# Altium schematic sheet MCU_PSoC.SchDoc
size A4
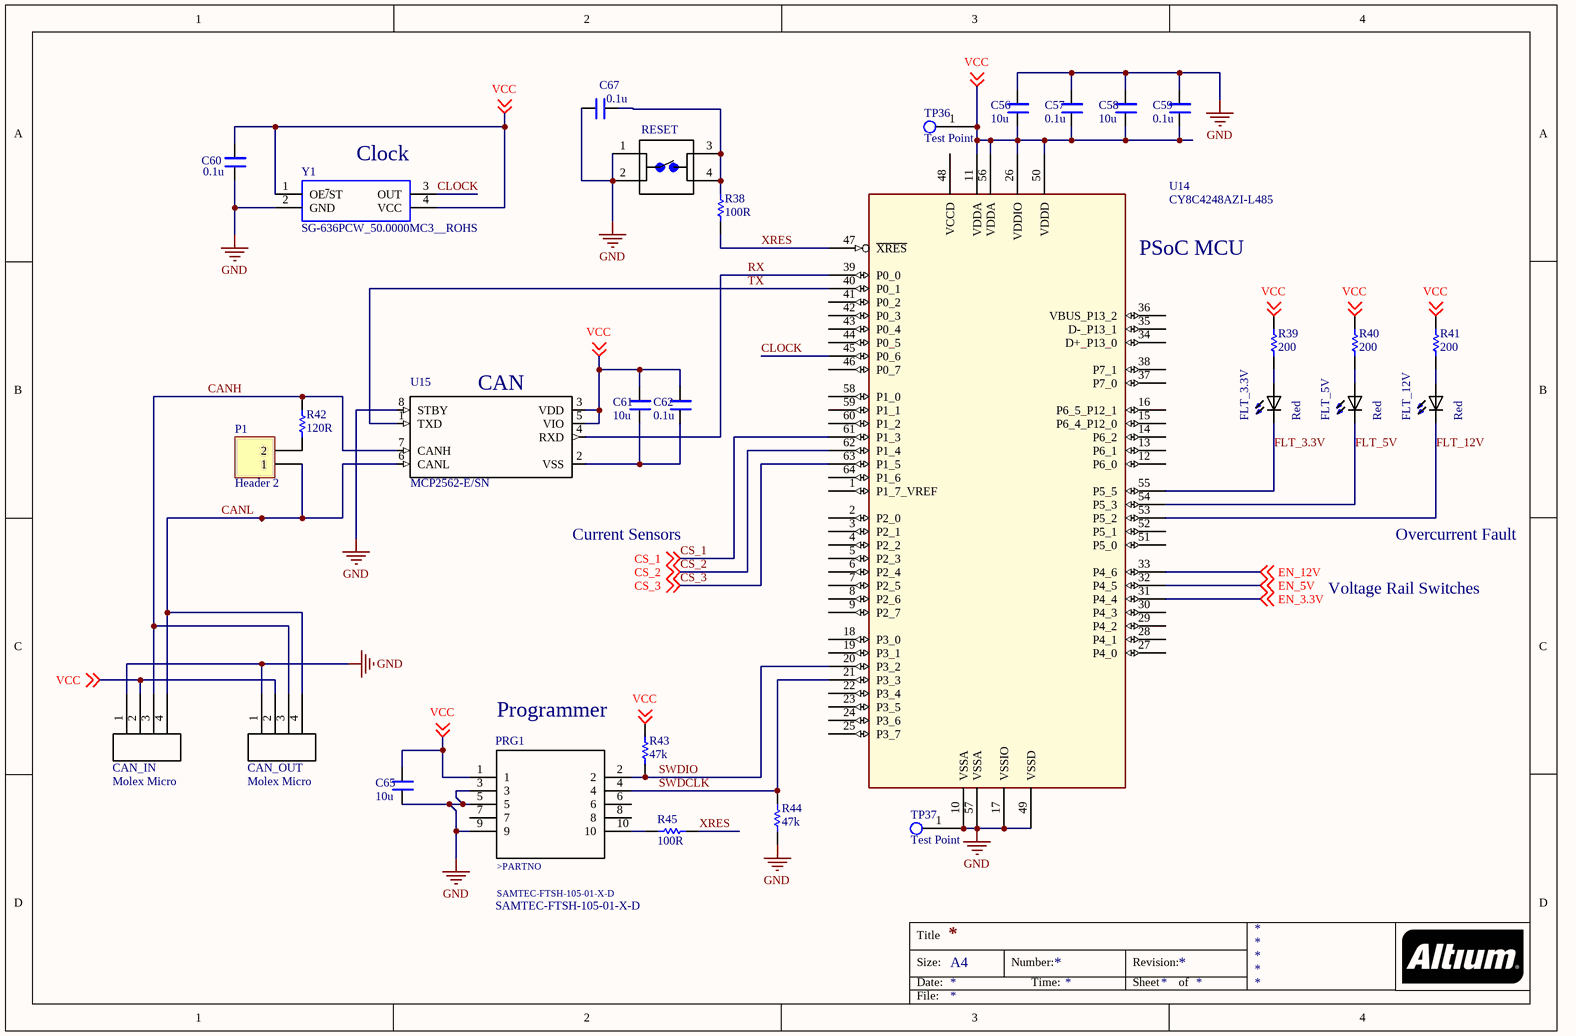
[diagram p0: MCU_PSoC.SchDoc]

## Parts
C56  10u  [*CAPC2012X88N]
C57  0.1u  [*CAPC2012X88N]
C58  10u  [*CAPC2012X88N]
C59  0.1u  [*CAPC2012X88N]
C60  0.1u  [*CAPC2012X88N]
C61  10u  [*CAPC2012X88N]
C62  0.1u  [*CAPC2012X88N]
C65  10u  [*CAPC2012X88N]
C67  0.1u  [*CAPC2012X88N]
CAN_IN  Molex Micro  [0430450427]
CAN_OUT  Molex Micro  [0430450427]
FLT_3.3V  Red  [*DIOC200X125X110_LTST-C171KSKT(Primary)]
FLT_5V  Red  [*DIOC200X125X110_LTST-C171KSKT(Primary)]
FLT_12V  Red  [*DIOC200X125X110_LTST-C171KSKT(Primary)]
P1  Header 2  [HDR1X2]
PRG1  SAMTEC-FTSH-105-01-X-D  [SAMTEC-FTSH-105-01-X-D]
R38  100R  [RESC0805(2012)_M]
R39  200  [RESC0805(2012)_M]
R40  200  [RESC0805(2012)_M]
R41  200  [RESC0805(2012)_M]
R42  120R  [RESC0805(2012)_N]
R43  47k  [RESC0805(2012)_M]
R44  47k  [RESC0805(2012)_M]
R45  100R  [RESC0805(2012)_M]
RESET  1825910-7  [Switch 6mm 24V (NO)]  (value not drawn)
TP36  Test Point  [Test Point Through-hole]
TP37  Test Point  [Test Point Through-hole]
U14  CY8C4248AZI-L485  [TQFP50P1200X1200X160-64N]
U15  MCP2562-E/SN  [SOIC127P600X175-8N]
Y1  SG-636PCW_50.0000MC3__ROHS  [SG-636]

## Nets
GND: C56.2 C57.2 C58.2 C59.2 C60.1 C65.1 C67.1 CAN_IN.1 CAN_OUT.1 PRG1.3 PRG1.5 PRG1.9 R44.2 RESET.1 RESET.2 TP37.1 U14.10(VSSA) U14.17(VSSIO) U14.49(VSSD) U14.57(VSSA) U15.8(STBY) Y1.2(GND)
CANH: CAN_IN.3 CAN_OUT.3 R42.2 U15.7(CANH)
CANL: CAN_IN.4 CAN_OUT.4 P1.1 U15.6(CANL)
CLOCK: U14.45(P0_6) Y1.3(OUT)
CS_1: U14.61(P1_3) ; off-sheet CS_1
CS_2: U14.62(P1_4) ; off-sheet CS_2
CS_3: U14.63(P1_5) ; off-sheet CS_3
EN_3.3V: U14.31(P4_4) ; off-sheet EN_3.3V
EN_5V: U14.32(P4_5) ; off-sheet EN_5V
EN_12V: U14.33(P4_6) ; off-sheet EN_12V
FLT_3.3V: FLT_3.3V.NEG U14.55(P5_5)
FLT_5V: FLT_5V.NEG U14.54(P5_3)
FLT_12V: FLT_12V.NEG U14.53(P5_2)
RX: U14.39(P0_0) U15.4(RXD)
SWDCLK: PRG1.4 R44.1 U14.21(P3_3)
SWDIO: PRG1.2 R43.2 U14.20(P3_2)
TX: U14.40(P0_1) U15.1(TXD)
VCC: C56.1 C57.1 C58.1 C59.1 C60.2 C61.2 C62.2 C65.2 CAN_IN.2 CAN_OUT.2 PRG1.1 R39.2 R40.2 R41.2 R43.1 TP36.1 U14.11(VDDA) U14.26(VDDIO) U14.50(VDDD) U14.56(VDDA) U15.3(VDD) U15.5(VIO) Y1.1(OE~{/}ST) Y1.4(VCC) ; off-sheet VCC
XRES: R38.2 R45.1 U14.47(~{XRES})
NetC61_1: C61.1 C62.1 U15.2(VSS)
NetC67_2: C67.2 R38.1 RESET.3 RESET.4
NetFLT_3.3V_POS: FLT_3.3V.POS R39.1
NetFLT_5V_POS: FLT_5V.POS R40.1
NetFLT_12V_POS: FLT_12V.POS R41.1
NetP1_2: P1.2 R42.1
NetPRG1_10: PRG1.10 R45.2

Not connected (* = marked no-connect by the designer): PRG1 6 7 8; U14 1(P1_7_VREF) 2(P2_0) 3(P2_1) 4(P2_2) 5(P2_3) 6(P2_4) 7(P2_5) 8(P2_6) 9(P2_7) 12(P6_0) 13(P6_1) 14(P6_2) 15(P6_4_P12_0) 16(P6_5_P12_1) 18(P3_0) 19(P3_1) 22(P3_4) 23(P3_5) 24(P3_6) 25(P3_7) 27(P4_0) 28(P4_1) 29(P4_2) 30(P4_3) 34(D+_P13_0) 35(D-_P13_1) 36(VBUS_P13_2) 37(P7_0) 38(P7_1) 41(P0_2) 42(P0_3) 43(P0_4) 44(P0_5) 46(P0_7) 48(VCCD) 51(P5_0) 52(P5_1) 58(P1_0) 59(P1_1) 60(P1_2) 64(P1_6)

## Notes on the sheet
- (near Y1) Clock
- (near U14) PSoC MCU
- (near U15) CAN
- Current Sensors
- Overcurrent Fault
- Voltage Rail Switches
- Programmer
- Title
- Size:
- Date:
- A4
- Number:
- Time:
- Revision:
- Sheet
- of
- File:
- (in symbol SAMTEC-FTSH-105-01-X-D) >PARTNO

## Library data of the parts
C56-C62 C65 C67 = C0805C101JAGAC7800: / 100pF Â±5% 250V Ceramic Capacitor C0G, NP0 0805 _2012 Metric_ /; MF: KEMET; Package: 0805 KEMET; Digi-Key_Part_Number: 399-15000-1-ND; MP: C0805C101JAGAC7800; Digi-Key_Purchase_URL: https://www.digikey.com/product-detail/en/kemet/C0805C101JAGAC7800/399-15000-1-ND/7382549?utm_source=snapeda&utm_medium=aggregator&utm_campaign=symbol; SnapEDA_Link: https://www.snapeda.com/parts/C0805C101JAGAC7800/KEMET/view-part/3661430/?ref=snap; Value: *
CAN_IN CAN_OUT = Molex micro-fit 4-pin (Single row schematic): Molex micro-fit 3.0 dual row header. P/N 0430450427
FLT_3.3V FLT_5V FLT_12V = LTST-C171KSKT: / Yellow 2 x 1.25 x 0.8 mm 130Â° Water Clear 50 mcd 2 V LED SMT /; MF: Lite-On Inc.; SnapEDA_Link: https://www.snapeda.com/parts/LTST-C171KSKT/Lite-On%20Inc./view-part/?ref=snap; Package: 0805 Lite-On; MP: LTST-C171KSKT; Digi-Key_Part_Number: 160-1428-1-ND; Digi-Key_Purchase_URL: https://www.digikey.com/product-detail/en/lite-on-inc/LTST-C171KSKT/160-1428-1-ND/386802?utm_source=snapeda&utm_medium=aggregator&utm_campaign=symbol; Value: *
P1 = Header 2: Header, 2-Pin; LatestRevisionDate: 17-Jul-2002; LatestRevisionNote: Re-released for DXP Platform.; Publisher: Altium Limited
PRG1 = SAMTEC-FTSH-105-01-X-D: SAMTEC-FTSH-105-01-X-D. Shrouded 10-pin header with .05 in pitch.
R38-R41 R43-R45 = CMP-1013-00951-1: 8M06 0.125W 1% 0805 (2012 Metric)  SMD; Value: 8060000.00 Ohm; Case-EIA: 0805; Case-Metric: 2012; Power: 0.125 W; Technology: SMT; Tolerance: 1 %
R42 = 120R 5% 0805: 120R 0.125W 5% 0805 (2012 Metric)  SMD; Case-Metric: 2012; Value: 120.00 Ohm; Case-EIA: 0805; Tolerance: 5 %; Technology: SMT; Power: 0.125 W
RESET = Switch 6mm 24V (NO): FSM4JAH=6MM TACT SWITCH, HIGH TEMP; MF: TE Connectivity; Contact_Current_Rating: 50 mA; Configuration_Pole-Throw: Single Pole - Single Throw; Package: None; Digi-Key_Part_Number: 450-1804-ND; Digi-Key_Purchase_URL: https://www.digikey.com/product-detail/en/te-connectivity-alcoswitch-switches/1825910-7/450-1804-ND/1731414?utm_source=snapeda&utm_medium=aggregator&utm_campaign=symbol; MP: 1825910-7; SnapEDA_Link: https://www.snapeda.com/parts/1825910-7/TE%20Connectivity%20ALCOSWITCH%20Switches/view-part/?ref=snap; EU_RoHS_Compliance: Compliant; TE_purchase_URL: https://www.te.com/usa-en/product-1825910-7.html?te_bu=Cor&te_type=disp&te_campaign=seda_glo_cor-seda-global-disp-prtnr-fy19-seda-model-bom-cta_sma-317_1&elqCampaignId=32493; Value: *
U15 = MCP2562-E/SN: Microchip MCP2562-E/SN, CAN Transceiver 1MBps 1-channel IEC 61000-4-2, 8-Pin SOIC; Price: None; MF: Microchip; SnapEDA_Link: https://www.snapeda.com/parts/MCP2562-E/SN/Microchip/view-part/?ref=snap; MP: MCP2562-E/SN; Availability: Unavailable; Package: SO-8 Microchip; Value: *
Y1 = SG-636: Standard Clock Oscillators 50MHz 3.3Volt 100ppm -20C +70C; Manufacturer_Name: Epson Timing; Manufacturer_Part_Number: SG-636PCW 50.0000MC3: ROHS; RS Part Number: *; RS Price/Stock: *; Arrow Part Number: SG-636PCW 50.0000MC3: ROHS; Arrow Price/Stock: *; Datasheet Link: http://www.mouser.com/ds/2/137/G-636PCE_en-1003252.pdf
U14 = CY8C4248AZI-L485: Part_Number: CY8C4248AZI-L485